# Altium schematic sheet type-c.SchDoc
size A4
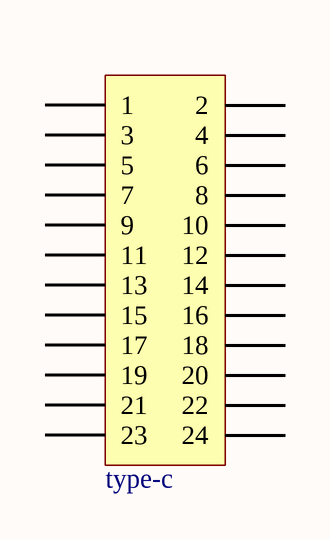
[diagram p0: type-c.SchDoc]

## Parts
?  type-c

## Nets

Not connected (* = marked no-connect by the designer): ? 1 2 3 4 5 6 7 8 9 10 11 12 13 14 15 16 17 18 19 20 21 22 23 24

## Library data of the parts
? = Header 12X2: Header, 12-Pin, Dual row; LatestRevisionDate: 17-Jul-2002; LatestRevisionNote: Re-released for DXP Platform.; Publisher: Altium Limited